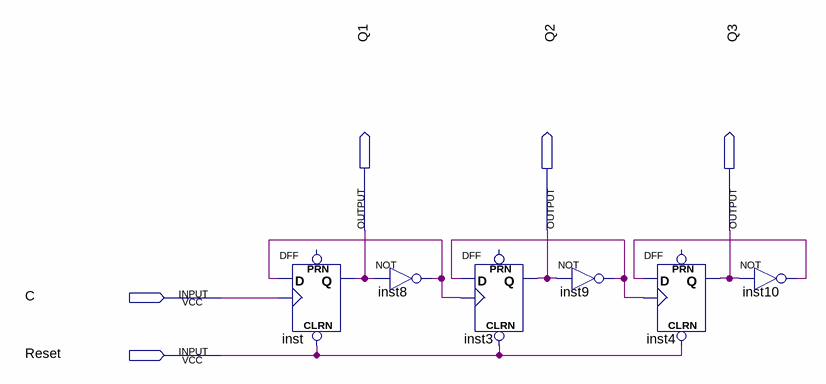
[diagram p0: schematic sheet]
// Quartus schematic z32.bdf as structural Verilog: 6 symbols, 5 pins
module z32 (
  input  C,
  input  Reset,
  output Q1,
  output Q2,
  output Q3
);

  wire inst8_out, inst9_out, inst10_out;

  DFF inst (.CLRN(Reset), .CLK(C), .D(inst8_out), .Q(Q1));  // open: PRN
  not inst8 (inst8_out, Q1);
  DFF inst3 (.CLRN(Reset), .CLK(inst8_out), .D(inst9_out), .Q(Q2));  // open: PRN
  not inst9 (inst9_out, Q2);
  DFF inst4 (.CLRN(Reset), .CLK(inst9_out), .D(inst10_out), .Q(Q3));  // open: PRN
  not inst10 (inst10_out, Q3);
endmodule
